# Altium schematic sheet SDRAM_DDR3_2x16.SchDoc: Sayma AMC
size 420 x 297 mm; $$Internal___BlkDate: 0:12:25_2-9-18; $$Internal_NAME_PLACEHOLDER: a3sheet; $$Internal_Resolution: 00001mm; $$NotCommonProperty_@PRINTORDER: 3; $$NotCommonProperty_FORWARD_PCB: 0; $$NotCommonProperty_REVISION: 0; @DATETIME: 10-1-2003_18:26; @NAME: SDRAM_DDR3_2x16; @SHEET: 1; @SHEETTOTAL: 30; CmpIndex: 131; Drawing Author: G.Kasprowicz; Drawing Number: Sayma AMC; Drawing Project: AMC FMC Carrier Board; Drawing Revision: 2.0; SymIndex: 2141; CheckedBy: P.Kulik,T.Przywozki,W.Ruclo; Author: G.Kasprowicz; CompanyName: WUT ISE; DrawnBy: G.Kasprowicz; Organization: WUT ISE; Address1: PW ISE; Address2: Nowowiejska 15/19 00-665 Warsaw; Address3: gkasprow@gmail.com; DocumentNumber: 28; Revision: 2; SheetNumber: 28; SheetTotal: 32; ModifiedBy: -; CheckedDate: -; Title2: DDR3 - 32bit; DivGrp: WUT ISE; Designer: G.Kasprowicz; ModifiedDate: -; ProjectName: Sensor Box
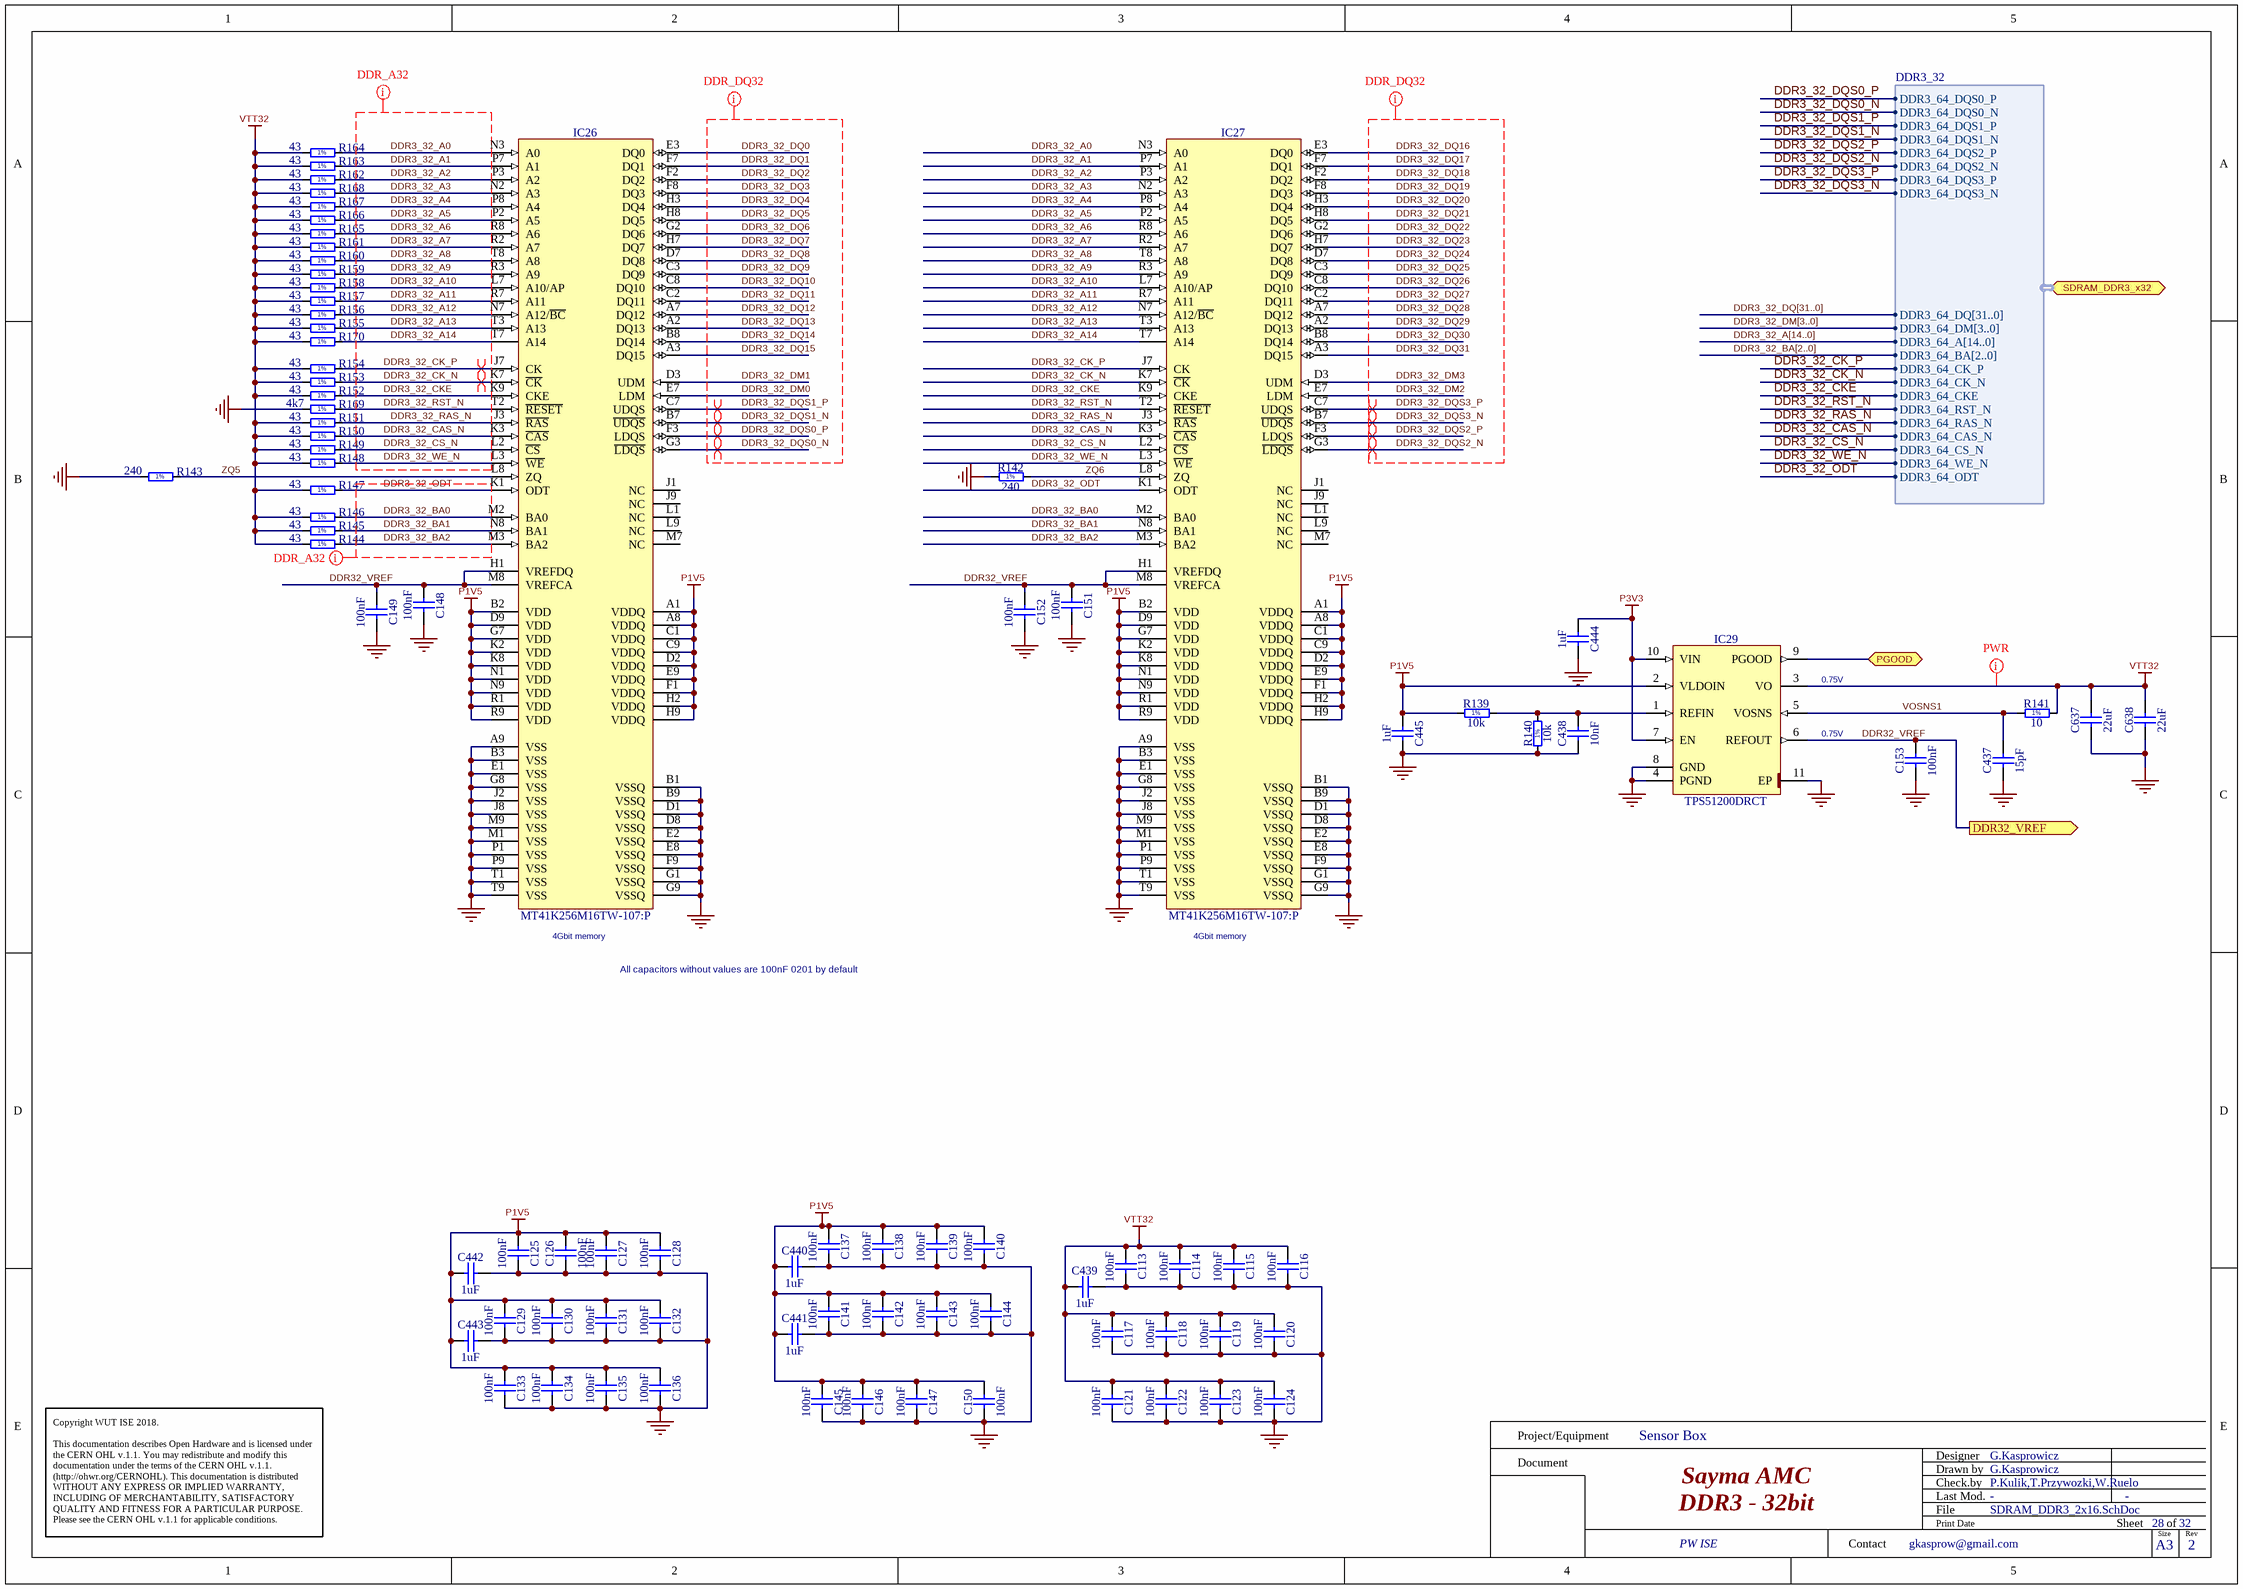
[diagram p0: SDRAM_DDR3_2x16.SchDoc]

## Parts
C113  100nF  [CAPC0603X33N]
C114  100nF  [CAPC0603X33N]
C115  100nF  [CAPC0603X33N]
C116  100nF  [CAPC0603X33N]
C117  100nF  [CAPC0603X33N]
C118  100nF  [CAPC0603X33N]
C119  100nF  [CAPC0603X33N]
C120  100nF  [CAPC0603X33N]
C121  100nF  [CAPC0603X33N]
C122  100nF  [CAPC0603X33N]
C123  100nF  [CAPC0603X33N]
C124  100nF  [CAPC0603X33N]
C125  100nF  [CAPC0603X33N]
C126  100nF  [CAPC0603X33N]
C127  100nF  [CAPC0603X33N]
C128  100nF  [CAPC0603X33N]
C129  100nF  [CAPC0603X33N]
C130  100nF  [CAPC0603X33N]
C131  100nF  [CAPC0603X33N]
C132  100nF  [CAPC0603X33N]
C133  100nF  [CAPC0603X33N]
C134  100nF  [CAPC0603X33N]
C135  100nF  [CAPC0603X33N]
C136  100nF  [CAPC0603X33N]
C137  100nF  [CAPC0603X33N]
C138  100nF  [CAPC0603X33N]
C139  100nF  [CAPC0603X33N]
C140  100nF  [CAPC0603X33N]
C141  100nF  [CAPC0603X33N]
C142  100nF  [CAPC0603X33N]
C143  100nF  [CAPC0603X33N]
C144  100nF  [CAPC0603X33N]
C145  100nF  [CAPC0603X33N]
C146  100nF  [CAPC0603X33N]
C147  100nF  [CAPC0603X33N]
C148  100nF  [CAPC0603X33N]
C149  100nF  [CAPC0603X33N]
C150  100nF  [CAPC0603X33N]
C151  100nF  [CAPC0603X33N]
C152  100nF  [CAPC0603X33N]
C153  100nF  [CAPC0603X33N]
C437  15pF  [CAPC1005X55N]
C438  10nF  [CAPC1005X55N]
C439  1uF  [CAPC1005X55N]
C440  1uF  [CAPC1005X55N]
C441  1uF  [CAPC1005X55N]
C442  1uF  [CAPC1005X55N]
C443  1uF  [CAPC1005X55N]
C444  1uF  [CAPC1005X55N]
C445  1uF  [CAPC1005X55N]
C637  22uF  [CAPC2012X135N]
C638  22uF  [CAPC2012X135N]
IC26  MT41K256M16TW-107:P  [BGA96C80P9X16_800X1400X120]
IC27  MT41K256M16TW-107:P  [BGA96C80P9X16_800X1400X120]
IC29  TPS51200DRCT  [TEXAS_DRC (S-PVSON-N10)]
R139  10k  [RESC1005X40N]
R140  10k  [RESC1005X40N]
R141  10  [RESC1005X40N]
R142  240  [RESC1005X40N]
R143  240  [RESC1005X40N]
R144  43  [RESC1005X40N]
R145  43  [RESC1005X40N]
R146  43  [RESC1005X40N]
R147  43  [RESC1005X40N]
R148  43  [RESC1005X40N]
R149  43  [RESC1005X40N]
R150  43  [RESC1005X40N]
R151  43  [RESC1005X40N]
R152  43  [RESC1005X40N]
R153  43  [RESC1005X40N]
R154  43  [RESC1005X40N]
R155  43  [RESC1005X40N]
R156  43  [RESC1005X40N]
R157  43  [RESC1005X40N]
R158  43  [RESC1005X40N]
R159  43  [RESC1005X40N]
R160  43  [RESC1005X40N]
R161  43  [RESC1005X40N]
R162  43  [RESC1005X40N]
R163  43  [RESC1005X40N]
R164  43  [RESC1005X40N]
R165  43  [RESC1005X40N]
R166  43  [RESC1005X40N]
R167  43  [RESC1005X40N]
R168  43  [RESC1005X40N]
R169  4k7  [RESC1005X40N]
R170  43  [RESC1005X40N]

## Ports
DDR32_VREF (out), PGOOD (bidir), SDRAM_DDR3_x32 (bidir, harness DDR3_32)

## Harnesses
DDR3_32: DDR3_64_DQS0_P, DDR3_64_DQS0_N, DDR3_64_DQS1_P, DDR3_64_DQS1_N, DDR3_64_DQS2_P, DDR3_64_DQS2_N, DDR3_64_DQS3_P, DDR3_64_DQS3_N, DDR3_64_DQ[31..0], DDR3_64_DM[3..0], DDR3_64_A[14..0], DDR3_64_BA[2..0], DDR3_64_CK_P, DDR3_64_CK_N, DDR3_64_CKE, DDR3_64_RST_N, DDR3_64_RAS_N, DDR3_64_CAS_N, DDR3_64_CS_N, DDR3_64_WE_N, DDR3_64_ODT

## Nets
GND: C113.2 C114.2 C115.2 C116.2 C117.2 C118.2 C119.2 C120.2 C121.2 C122.2 C123.2 C124.2 C125.2 C126.2 C127.2 C128.2 C129.2 C130.2 C131.2 C132.2 C133.2 C134.2 C135.2 C136.2 C137.2 C138.2 C139.2 C140.2 C141.2 C142.2 C143.2 C144.2 C145.2 C146.2 C147.2 C148.2 C149.2 C150.1 C151.2 C152.2 C153.1 C437.1 C438.1 C439.2 C440.2 C441.2 C442.2 C443.2 C444.2 C445.2 C637.1 C638.1 IC26.A9(VSS) IC26.B1(VSSQ) IC26.B3(VSS) IC26.B9(VSSQ) IC26.D1(VSSQ) IC26.D8(VSSQ) IC26.E1(VSS) IC26.E2(VSSQ) IC26.E8(VSSQ) IC26.F9(VSSQ) IC26.G1(VSSQ) IC26.G8(VSS) IC26.G9(VSSQ) IC26.J2(VSS) IC26.J8(VSS) IC26.M1(VSS) IC26.M9(VSS) IC26.P1(VSS) IC26.P9(VSS) IC26.T1(VSS) IC26.T9(VSS) IC27.A9(VSS) IC27.B1(VSSQ) IC27.B3(VSS) IC27.B9(VSSQ) IC27.D1(VSSQ) IC27.D8(VSSQ) IC27.E1(VSS) IC27.E2(VSSQ) IC27.E8(VSSQ) IC27.F9(VSSQ) IC27.G1(VSSQ) IC27.G8(VSS) IC27.G9(VSSQ) IC27.J2(VSS) IC27.J8(VSS) IC27.M1(VSS) IC27.M9(VSS) IC27.P1(VSS) IC27.P9(VSS) IC27.T1(VSS) IC27.T9(VSS) IC29.4(PGND) IC29.8(GND) IC29.11(EP) R140.1 R142.1 R143.1 R169.1
P1V5: C125.1 C126.1 C127.1 C128.1 C129.1 C130.1 C131.1 C132.1 C133.1 C134.1 C135.1 C136.1 C137.1 C138.1 C139.1 C140.1 C141.1 C142.1 C143.1 C144.1 C145.1 C146.1 C147.1 C150.2 C440.1 C441.1 C442.1 C443.1 C445.1 IC26.A1(VDDQ) IC26.A8(VDDQ) IC26.B2(VDD) IC26.C1(VDDQ) IC26.C9(VDDQ) IC26.D2(VDDQ) IC26.D9(VDD) IC26.E9(VDDQ) IC26.F1(VDDQ) IC26.G7(VDD) IC26.H2(VDDQ) IC26.H9(VDDQ) IC26.K2(VDD) IC26.K8(VDD) IC26.N1(VDD) IC26.N9(VDD) IC26.R1(VDD) IC26.R9(VDD) IC27.A1(VDDQ) IC27.A8(VDDQ) IC27.B2(VDD) IC27.C1(VDDQ) IC27.C9(VDDQ) IC27.D2(VDDQ) IC27.D9(VDD) IC27.E9(VDDQ) IC27.F1(VDDQ) IC27.G7(VDD) IC27.H2(VDDQ) IC27.H9(VDDQ) IC27.K2(VDD) IC27.K8(VDD) IC27.N1(VDD) IC27.N9(VDD) IC27.R1(VDD) IC27.R9(VDD) IC29.2(VLDOIN) R139.1
P3V3: C444.1 IC29.7(EN) IC29.10(VIN)
VTT32: C113.1 C114.1 C115.1 C116.1 C117.1 C118.1 C119.1 C120.1 C121.1 C122.1 C123.1 C124.1 C439.1 C637.2 C638.2 IC29.3(VO) R141.2 R144.1 R145.1 R146.1 R147.1 R148.1 R149.1 R150.1 R151.1 R152.1 R153.1 R154.1 R155.1 R156.1 R157.1 R158.1 R159.1 R160.1 R161.1 R162.1 R163.1 R164.1 R165.1 R166.1 R167.1 R168.1 R170.1
DDR3_32_A0: IC26.N3(A0) IC27.N3(A0) R164.2
DDR3_32_A1: IC26.P7(A1) IC27.P7(A1) R163.2
DDR3_32_A2: IC26.P3(A2) IC27.P3(A2) R162.2
DDR3_32_A3: IC26.N2(A3) IC27.N2(A3) R168.2
DDR3_32_A4: IC26.P8(A4) IC27.P8(A4) R167.2
DDR3_32_A5: IC26.P2(A5) IC27.P2(A5) R166.2
DDR3_32_A6: IC26.R8(A6) IC27.R8(A6) R165.2
DDR3_32_A7: IC26.R2(A7) IC27.R2(A7) R161.2
DDR3_32_A8: IC26.T8(A8) IC27.T8(A8) R160.2
DDR3_32_A9: IC26.R3(A9) IC27.R3(A9) R159.2
DDR3_32_A10: IC26.L7(A10/AP) IC27.L7(A10/AP) R158.2
DDR3_32_A11: IC26.R7(A11) IC27.R7(A11) R157.2
DDR3_32_A12: IC26.N7(A12/~{BC}) IC27.N7(A12/~{BC}) R156.2
DDR3_32_A13: IC26.T3(A13) IC27.T3(A13) R155.2
DDR3_32_A14: IC26.T7(A14) IC27.T7(A14) R170.2
DDR3_32_BA0: IC26.M2(BA0) IC27.M2(BA0) R146.2
DDR3_32_BA1: IC26.N8(BA1) IC27.N8(BA1) R145.2
DDR3_32_BA2: IC26.M3(BA2) IC27.M3(BA2) R144.2
DDR3_32_CAS_N: IC26.K3(~{CAS}) IC27.K3(~{CAS}) R150.2 ; port SDRAM_DDR3_x32.DDR3_64_CAS_N
DDR3_32_CK_N: IC26.K7(~{CK}) IC27.K7(~{CK}) R153.2 ; port SDRAM_DDR3_x32.DDR3_64_CK_N
DDR3_32_CK_P: IC26.J7(CK) IC27.J7(CK) R154.2 ; port SDRAM_DDR3_x32.DDR3_64_CK_P
DDR3_32_CKE: IC26.K9(CKE) IC27.K9(CKE) R152.2 ; port SDRAM_DDR3_x32.DDR3_64_CKE
DDR3_32_CS_N: IC26.L2(~{CS}) IC27.L2(~{CS}) R149.2 ; port SDRAM_DDR3_x32.DDR3_64_CS_N
DDR3_32_DM0: IC26.E7(LDM)
DDR3_32_DM1: IC26.D3(UDM)
DDR3_32_DM2: IC27.E7(LDM)
DDR3_32_DM3: IC27.D3(UDM)
DDR3_32_DQ0: IC26.E3(DQ0)
DDR3_32_DQ1: IC26.F7(DQ1)
DDR3_32_DQ2: IC26.F2(DQ2)
DDR3_32_DQ3: IC26.F8(DQ3)
DDR3_32_DQ4: IC26.H3(DQ4)
DDR3_32_DQ5: IC26.H8(DQ5)
DDR3_32_DQ6: IC26.G2(DQ6)
DDR3_32_DQ7: IC26.H7(DQ7)
DDR3_32_DQ8: IC26.D7(DQ8)
DDR3_32_DQ9: IC26.C3(DQ9)
DDR3_32_DQ10: IC26.C8(DQ10)
DDR3_32_DQ11: IC26.C2(DQ11)
DDR3_32_DQ12: IC26.A7(DQ12)
DDR3_32_DQ13: IC26.A2(DQ13)
DDR3_32_DQ14: IC26.B8(DQ14)
DDR3_32_DQ15: IC26.A3(DQ15)
DDR3_32_DQ16: IC27.E3(DQ0)
DDR3_32_DQ17: IC27.F7(DQ1)
DDR3_32_DQ18: IC27.F2(DQ2)
DDR3_32_DQ19: IC27.F8(DQ3)
DDR3_32_DQ20: IC27.H3(DQ4)
DDR3_32_DQ21: IC27.H8(DQ5)
DDR3_32_DQ22: IC27.G2(DQ6)
DDR3_32_DQ23: IC27.H7(DQ7)
DDR3_32_DQ24: IC27.D7(DQ8)
DDR3_32_DQ25: IC27.C3(DQ9)
DDR3_32_DQ26: IC27.C8(DQ10)
DDR3_32_DQ27: IC27.C2(DQ11)
DDR3_32_DQ28: IC27.A7(DQ12)
DDR3_32_DQ29: IC27.A2(DQ13)
DDR3_32_DQ30: IC27.B8(DQ14)
DDR3_32_DQ31: IC27.A3(DQ15)
DDR3_32_DQS0_N: IC26.G3(~{LDQS}) ; port SDRAM_DDR3_x32.DDR3_64_DQS0_N
DDR3_32_DQS0_P: IC26.F3(LDQS) ; port SDRAM_DDR3_x32.DDR3_64_DQS0_P
DDR3_32_DQS1_N: IC26.B7(~{UDQS}) ; port SDRAM_DDR3_x32.DDR3_64_DQS1_N
DDR3_32_DQS1_P: IC26.C7(UDQS) ; port SDRAM_DDR3_x32.DDR3_64_DQS1_P
DDR3_32_DQS2_N: IC27.G3(~{LDQS}) ; port SDRAM_DDR3_x32.DDR3_64_DQS2_N
DDR3_32_DQS2_P: IC27.F3(LDQS) ; port SDRAM_DDR3_x32.DDR3_64_DQS2_P
DDR3_32_DQS3_N: IC27.B7(~{UDQS}) ; port SDRAM_DDR3_x32.DDR3_64_DQS3_N
DDR3_32_DQS3_P: IC27.C7(UDQS) ; port SDRAM_DDR3_x32.DDR3_64_DQS3_P
DDR3_32_ODT: IC26.K1(ODT) IC27.K1(ODT) R147.2 ; port SDRAM_DDR3_x32.DDR3_64_ODT
DDR3_32_RAS_N: IC26.J3(~{RAS}) IC27.J3(~{RAS}) R151.2 ; port SDRAM_DDR3_x32.DDR3_64_RAS_N
DDR3_32_RST_N: IC26.T2(~{RESET}) IC27.T2(~{RESET}) R169.2 ; port SDRAM_DDR3_x32.DDR3_64_RST_N
DDR3_32_WE_N: IC26.L3(~{WE}) IC27.L3(~{WE}) R148.2 ; port SDRAM_DDR3_x32.DDR3_64_WE_N
DDR32_VREF: C148.1 C149.1 C151.1 C152.1 C153.2 IC26.H1(VREFDQ) IC26.M8(VREFCA) IC27.H1(VREFDQ) IC27.M8(VREFCA) IC29.6(REFOUT) ; port DDR32_VREF
PGOOD: IC29.9(PGOOD) ; port PGOOD
VOSNS1: C437.2 IC29.5(VOSNS) R141.1
ZQ5: IC26.L8(ZQ) R143.2
ZQ6: IC27.L8(ZQ) R142.2
NetC438_2: C438.2 IC29.1(REFIN) R139.2 R140.2

Not connected (* = marked no-connect by the designer): IC26 J1(NC) J9(NC) L1(NC) L9(NC) M7(NC); IC27 J1(NC) J9(NC) L1(NC) L9(NC) M7(NC)

## Buses and harness runs
bus DDR3_32_A[14..0]
bus DDR3_32_BA[2..0]
bus DDR3_32_DM[3..0]
bus DDR3_32_DQ[31..0]

## Layout directives
differential pair: DDR3_32_CK_N, DDR3_32_CK_P, DDR3_32_DQS0_N, DDR3_32_DQS0_P, DDR3_32_DQS1_N, DDR3_32_DQS1_P, DDR3_32_DQS2_N, DDR3_32_DQS2_P, DDR3_32_DQS3_N, DDR3_32_DQS3_P
net class DDR_DQ32: DDR3_32_DM0, DDR3_32_DM1, DDR3_32_DM2, DDR3_32_DM3, DDR3_32_DQ0, DDR3_32_DQ1, DDR3_32_DQ2, DDR3_32_DQ3, DDR3_32_DQ4, DDR3_32_DQ5, DDR3_32_DQ6, DDR3_32_DQ7, DDR3_32_DQ8, DDR3_32_DQ9, DDR3_32_DQ10, DDR3_32_DQ11, DDR3_32_DQ12, DDR3_32_DQ13, DDR3_32_DQ14, DDR3_32_DQ15, DDR3_32_DQ16, DDR3_32_DQ17, DDR3_32_DQ18, DDR3_32_DQ19, DDR3_32_DQ20, DDR3_32_DQ21, DDR3_32_DQ22, DDR3_32_DQ23, DDR3_32_DQ24, DDR3_32_DQ25, DDR3_32_DQ26, DDR3_32_DQ27, DDR3_32_DQ28, DDR3_32_DQ29, DDR3_32_DQ30, DDR3_32_DQ31, DDR3_32_DQS0_N, DDR3_32_DQS0_P, DDR3_32_DQS1_N, DDR3_32_DQS1_P, DDR3_32_DQS2_N, DDR3_32_DQS2_P, DDR3_32_DQS3_N, DDR3_32_DQS3_P
net class DDR_A32: DDR3_32_A0, DDR3_32_A1, DDR3_32_A2, DDR3_32_A3, DDR3_32_A4, DDR3_32_A5, DDR3_32_A6, DDR3_32_A7, DDR3_32_A8, DDR3_32_A9, DDR3_32_A10, DDR3_32_A11, DDR3_32_A12, DDR3_32_A13, DDR3_32_A14, DDR3_32_BA0, DDR3_32_BA1, DDR3_32_BA2, DDR3_32_CAS_N, DDR3_32_CK_N, DDR3_32_CK_P, DDR3_32_CKE, DDR3_32_CS_N, DDR3_32_ODT, DDR3_32_RAS_N, DDR3_32_RST_N, DDR3_32_WE_N
net class PWR: VTT32

## Notes on the sheet
- (near IC29) 0.75V
- (near IC26) 4Gbit memory
- (near IC27) 4Gbit memory
- All capacitors without values are 100nF 0201 by default
- Project/Equipment
- Document
- Designer
- Drawn by
- Check.by
- Copyright WUT ISE 2018.
  This documentation describes Open Hardware and is licensed under the CERN OHL v.1.1. You may redistribute and modify this documentation under the terms of the CERN OHL v.1.1. (http://ohwr.org/CERNOHL). This documentation is distributed WITHOUT ANY EXPRESS OR IMPLIED WARRANTY, INCLUDING OF MERCHANTABILITY, SATISFACTORY QUALITY AND FITNESS FOR A PARTICULAR PURPOSE. Please see the CERN OHL v.1.1 for applicable conditions.
- Contact
- File
- Last Mod.
- Print Date
- Sheet
- Size
- A3
- of
- Rev
- (in symbol R0402_4K7_1%_0.0625W_100PPM) 1%
- (in symbol R0402_10K_1%_0.0625W_100PPM) 1%
- (in symbol R0402_10R_1%_0.0625W_200PPM) 1%
- (in symbol R0402_43R_1%_0.0625W_100PPM) 1%
- (in symbol R0402_240R_1%_0.0625W_100PPM) 1%

## Library data of the parts
C113-C153 = CC0201_100NF_6.3V_10%_X5R: Non-polarised capacitor; Manufacturer: GENERIC; Part Description: SMD Multilayer Chip Ceramic Capacitor; Manufacturer1 Part Number: 02016D104KAT2A; Tolerance: ±10%; Voltage: 6.3V; TC: X5R; Manufacturer Part Number: CC0201_100NF_6.3V_10%_X5R; Part Number: CC0201_100NF_6.3V_10%_X5R; Value: 100nF; Component Kind: Standard; Component Type: Standard; Pin Count: 2; Status: Not Recommended; Case: 0201; Mounted: Yes; Socket: No; SMD: Yes; Sense: No; Manufacturer1 Example: AVX; Manufacturer1 ComponentHeight: 0.33mm; HelpURL: \\cern.ch\dfs\Applications\Altium\Datasheets\CC0201_X5R_AVX.pdf; Author: CERN DEM JLC; CreateDate: 03.12.2007; LatestRevisionDate: 03.12.2007
C437 = CC0402_15PF_50V_5%_C0G: Non-polarised capacitor; Manufacturer: GENERIC; Part Description: SMD Multilayer Chip Ceramic Capacitor; Manufacturer1 Part Number: C0402C150J5GACTU; Tolerance: ±5%; Voltage: 50V; TC: C0G/NP0; Manufacturer Part Number: CC0402_15PF_50V_5%_C0G; Part Number: CC0402_15PF_50V_5%_C0G; Value: 15pF; Component Kind: Standard; Component Type: Standard; Pin Count: 2; Status: Preferred; Case: 0402; Mounted: Yes; Socket: No; SMD: Yes; Sense: No; Manufacturer1 Example: KEMET; Manufacturer1 ComponentHeight: 0.55mm; HelpURL: \\cern.ch\dfs\Applications\Altium\Datasheets\CC0805_C0G_KEMET_(Commercial Grade).pdf; Author: CERN DEM JLC; CreateDate: 03.12.2007; LatestRevisionDate: 22.04.2015
C438 = CC0402_10NF_25V_10%_X7R: Non-polarised capacitor; Manufacturer: GENERIC; Part Description: SMD Multilayer Chip Ceramic Capacitor; Manufacturer1 Part Number: C1005X7R1E103KT; Tolerance: ±10%; Voltage: 25V; TC: X7R; Manufacturer Part Number: CC0402_10NF_25V_10%_X7R; Part Number: CC0402_10NF_25V_10%_X7R; Value: 10nF; Component Kind: Standard; Component Type: Standard; Pin Count: 2; Status: Preferred; Case: 0402; Mounted: Yes; Socket: No; SMD: Yes; Sense: No; Manufacturer1 Example: TDK; Manufacturer1 ComponentHeight: 0.55mm; HelpURL: \\cern.ch\dfs\Applications\Altium\Datasheets\CC0402_X7R_TDK_C.pdf; Author: CERN DEM JLC; CreateDate: 25.10.2012; LatestRevisionDate: 25.10.2012
C439-C445 = CC0402_1UF_16V_10%_X5R: Non-polarised capacitor; Manufacturer: GENERIC; Part Description: SMD Multilayer Chip Ceramic Capacitor; Manufacturer1 Part Number: C1005X5R1C105KT; Tolerance: ±10%; Voltage: 16V; TC: X5R; Manufacturer Part Number: CC0402_1UF_16V_10%_X5R; Part Number: CC0402_1UF_16V_10%_X5R; Value: 1uF; Component Kind: Standard; Component Type: Standard; Pin Count: 2; Status: Preferred; Case: 0402; Mounted: Yes; Socket: No; SMD: Yes; Sense: No; Manufacturer1 Example: TDK; Manufacturer1 ComponentHeight: 0.55mm; HelpURL: \\cern.ch\dfs\Applications\Altium\Datasheets\CC0402_X5R_TDK_C.pdf; Author: CERN DEM JLC; CreateDate: 25.10.2012; LatestRevisionDate: 25.10.2012
C637 C638 = CC0805_22UF_10V_+80%-20%_Y5V: Non-polarised capacitor; Manufacturer: GENERIC; Part Description: SMD Multilayer Chip Ceramic Capacitor; Manufacturer1 Part Number: 2222 241 19881; Voltage: 10V; TC: Y5V; Manufacturer Part Number: CC0805_22UF_10V_+80%-20%_Y5V; Part Number: CC0805_22UF_10V_+80%-20%_Y5V; Tolerance: +80% -20%; Value: 22uF; Component Kind: Standard; Component Type: Standard; Pin Count: 2; Status: Preferred; Case: 0805; Mounted: Yes; Socket: No; SMD: Yes; Sense: No; Manufacturer1 Example: PHYCOMP; Manufacturer1 ComponentHeight: 1.45mm; HelpURL: \\cern.ch\dfs\Applications\Altium\Datasheets\CC0805_Y5V_PHYCOMP.pdf; Author: CERN DEM JLC; CreateDate: 03.12.2007; LatestRevisionDate: 03.12.2007
IC26 IC27 = MT41K256M16TW-107:P: 32 Meg x 16 x 8 Banks DDR3L SDRAM; Manufacturer: MICRON TECHNOLOGY; Part Description: +1.5V, 4Gb (32Meg x 16 x 8 banks) DDR3L SDRAM; PressFit: No; Bonding: No; Manufacturer Part Number: MT41K256M16TW-107:P; Part Number: MT41K256M16TW-107:P; Component Kind: Standard; Component Type: Standard; Device: MT41K256M16TW-107:P; PackageDescription: BGA 0.8mm, Pitch, Square 96 Pin, 9 Columns x 16 Rows, Body 14mm X 8mm X 1.2mm H; Pin Count: 96; Case: BGA96; Mounted: Yes; Socket: No; SMD: Yes; Sense: No; ComponentHeight: 1.2mm; HelpURL: \\cern.ch\dfs\Applications\Altium\Datasheets\MT41K256M16TW-107-P.pdf; Author: CERN DEM MR; CreateDate: 14.12.2015; LatestRevisionDate: 14.12.2015
IC29 = TPS51200DRCT: Sink/Source DDR Termination Regulator; Manufacturer: TEXAS INSTRUMENTS; Part Description: 3.3V Sink/Source DDR Termination Regulator; PressFit: No; Bonding: No; Manufacturer Part Number: TPS51200DRCT; PackageDescription: SON, 0.50mm Pitch, 10-pin, 3.00mm W  X 3.00mm L X 1.00mm Height, (w/thermal tab 1.75 X 2.50 mm); Part Number: TPS51200DRCT; Component Kind: Standard; Component Type: Standard; Device: TPS51200DRCT; Pin Count: 11; Case: SON10; Mounted: Yes; Socket: No; SMD: Yes; Sense: No; ComponentHeight: 1mm; HelpURL: \\cern.ch\dfs\Applications\Altium\Datasheets\TPS51200DRCT.pdf; Author: CERN DEM JLC; CreateDate: 03.02.2010; LatestRevisionDate: 06.11.2013
R139 R140 = R0402_10K_1%_0.0625W_100PPM: Resistor - 1%; Manufacturer: GENERIC; Part Description: General Purpose Thick Film Chip Resistor; Manufacturer1 Part Number: 232270671003L; TC: ±100ppm/°C; PressFit: No; Manufacturer Part Number: R0402_10K_1%_0.0625W_100PPM; Part Number: R0402_10K_1%_0.0625W_100PPM; Tolerance: ±1%; Value: 10k; Component Kind: Standard; Component Type: Standard; Pin Count: 2; Status: Not Recommended; Power: 0.0625W; Case: 0402; Mounted: Yes; Sense: No; Socket: No; SMD: Yes; Manufacturer1 Example: YAGEO PHYCOMP; Manufacturer1 ComponentHeight: 0.4mm; HelpURL: \\cern.ch\dfs\Applications\Altium\Datasheets\R0402_Phycomp_RC0402.pdf; Author: CERN DEM JLC; CreateDate: 03.12.2007; LatestRevisionDate: 17.10.2012
R141 = R0402_10R_1%_0.0625W_200PPM: Resistor - 1%; Manufacturer: GENERIC; Part Description: General Purpose Thick Film Chip Resistor; Manufacturer1 Part Number: 232270671009L; TC: ±200ppm/°C; PressFit: No; Manufacturer Part Number: R0402_10R_1%_0.0625W_200PPM; Part Number: R0402_10R_1%_0.0625W_200PPM; Tolerance: ±1%; Value: 10; Component Kind: Standard; Component Type: Standard; Pin Count: 2; Status: Not Recommended; Power: 0.0625W; Case: 0402; Mounted: Yes; Sense: No; Socket: No; SMD: Yes; Manufacturer1 Example: YAGEO PHYCOMP; Manufacturer1 ComponentHeight: 0.4mm; HelpURL: \\cern.ch\dfs\Applications\Altium\Datasheets\R0402_Phycomp_RC0402.pdf; Author: CERN DEM JLC; CreateDate: 24.06.2009; LatestRevisionDate: 17.10.2012
R142 R143 = R0402_240R_1%_0.0625W_100PPM: Resistor - 1%; Manufacturer: GENERIC; Part Description: General Purpose Thick Film Chip Resistor; Manufacturer1 Part Number: 232270672401L; TC: ±100ppm/°C; PressFit: No; Manufacturer Part Number: R0402_240R_1%_0.0625W_100PPM; Part Number: R0402_240R_1%_0.0625W_100PPM; Tolerance: ±1%; Value: 240; Component Kind: Standard; Component Type: Standard; Pin Count: 2; Status: Not Recommended; Power: 0.0625W; Case: 0402; Mounted: Yes; Sense: No; Socket: No; SMD: Yes; Manufacturer1 Example: YAGEO PHYCOMP; Manufacturer1 ComponentHeight: 0.4mm; HelpURL: \\cern.ch\dfs\Applications\Altium\Datasheets\R0402_Phycomp_RC0402.pdf; Author: CERN DEM JLC; CreateDate: 03.12.2007; LatestRevisionDate: 17.10.2012
R144-R168 R170 = R0402_43R_1%_0.0625W_100PPM: Resistor - 1%; Manufacturer: GENERIC; Part Description: General Purpose Thick Film Chip Resistor; Manufacturer1 Part Number: 232270674309L; TC: ±100ppm/°C; PressFit: No; Manufacturer Part Number: R0402_43R_1%_0.0625W_100PPM; Part Number: R0402_43R_1%_0.0625W_100PPM; Tolerance: ±1%; Value: 43; Component Kind: Standard; Component Type: Standard; Pin Count: 2; Status: Not Recommended; Power: 0.0625W; Case: 0402; Mounted: Yes; Sense: No; Socket: No; SMD: Yes; Manufacturer1 Example: YAGEO PHYCOMP; Manufacturer1 ComponentHeight: 0.4mm; HelpURL: \\cern.ch\dfs\Applications\Altium\Datasheets\R0402_Phycomp_RC0402.pdf; Author: CERN DEM JLC; CreateDate: 03.12.2007; LatestRevisionDate: 17.10.2012
R169 = R0402_4K7_1%_0.0625W_100PPM: Resistor - 1%; Manufacturer: GENERIC; Part Description: General Purpose Thick Film Chip Resistor; Manufacturer1 Part Number: 232270674702L; TC: ±100ppm/°C; PressFit: No; Manufacturer Part Number: R0402_4K7_1%_0.0625W_100PPM; Part Number: R0402_4K7_1%_0.0625W_100PPM; Tolerance: ±1%; Value: 4k7; Component Kind: Standard; Component Type: Standard; Pin Count: 2; Status: Not Recommended; Power: 0.0625W; Case: 0402; Mounted: Yes; Sense: No; Socket: No; SMD: Yes; Manufacturer1 Example: YAGEO PHYCOMP; Manufacturer1 ComponentHeight: 0.4mm; HelpURL: \\cern.ch\dfs\Applications\Altium\Datasheets\R0402_Phycomp_RC0402.pdf; Author: CERN DEM JLC; CreateDate: 03.12.2007; LatestRevisionDate: 17.10.2012